# Altium project MCS_adapter.PrjPcb
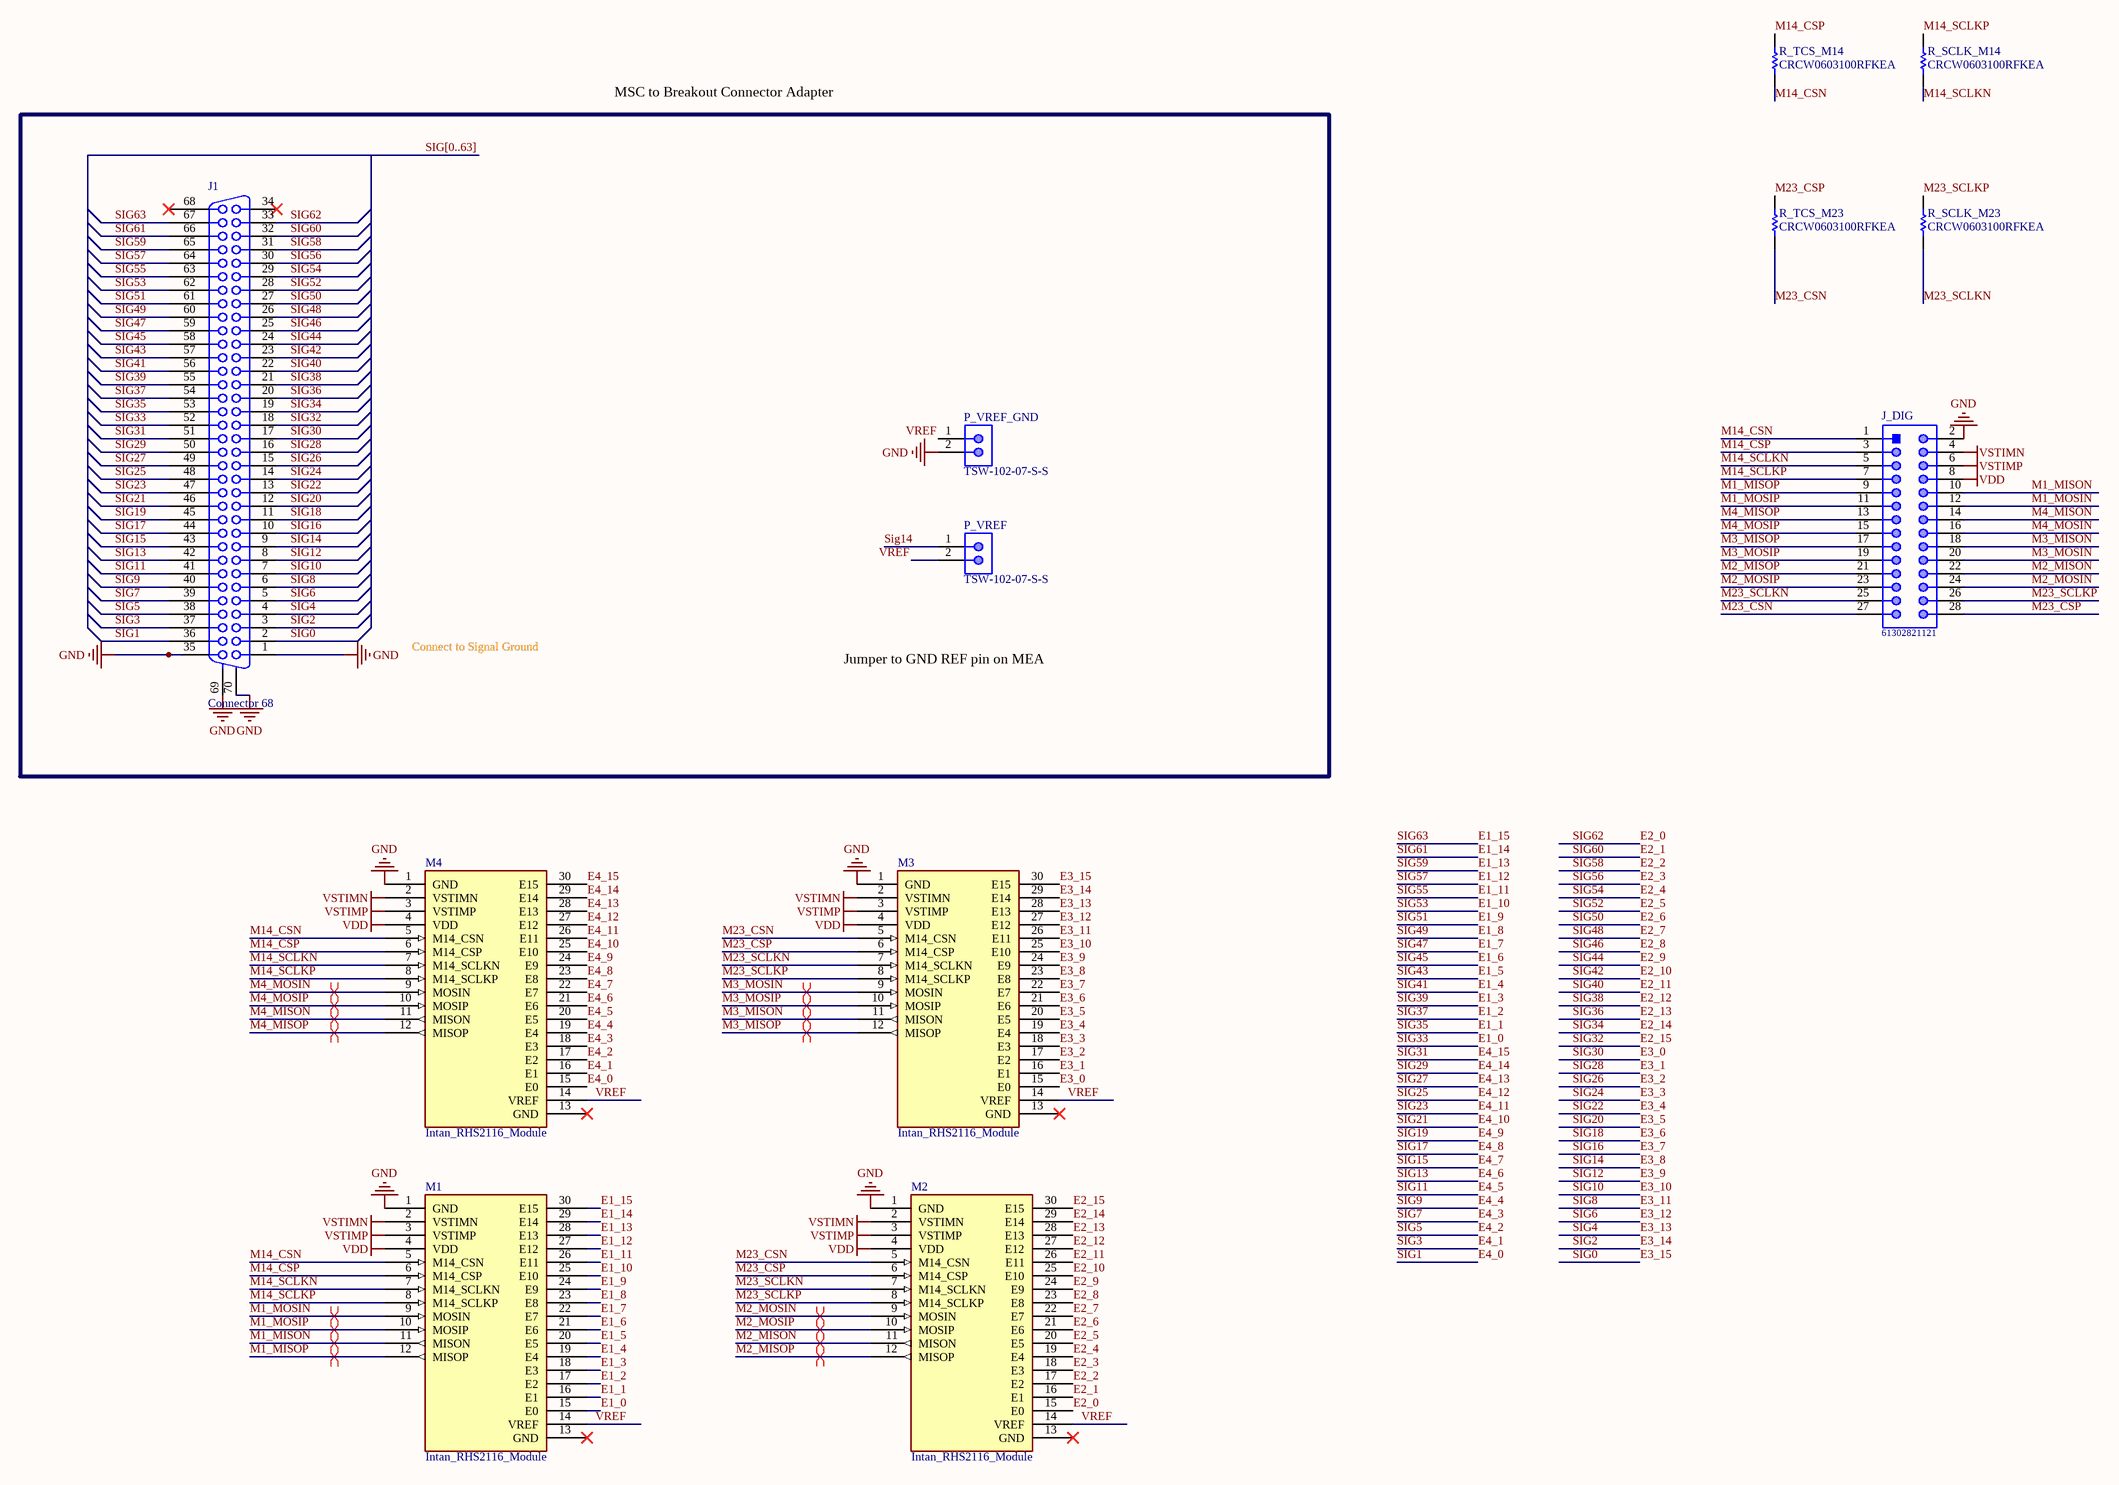
[diagram p0: MCS_adapter.SchDoc]
1 sheet, 12 parts. Net scope: hierarchical (ports join the sheet entries above them; power ports are global).
Board files: MCS_adapter_new_power_straps_t2.PcbDoc, MCS_adapter.PcbDoc

## Sheet MCS_adapter.SchDoc
size A2

### Parts
J1  Connector 68  [CONN_2-5174339-5_2-5174339-5(Primary)]
J_DIG  61302821121  [61302821121]
M1  Intan_RHS2116_Module  [Intan_RHS2116_Module]
M2  Intan_RHS2116_Module  [Intan_RHS2116_Module]
M3  Intan_RHS2116_Module  [Intan_RHS2116_Module]
M4  Intan_RHS2116_Module  [Intan_RHS2116_Module]
P_VREF  TSW-102-07-S-S  [SMTC-TSW-102-07-S-S]
P_VREF_GND  TSW-102-07-S-S  [SMTC-TSW-102-07-S-S]
R_SCLK_M14  CRCW0603100RFKEA  [RESC1609X50X30ML8T20]
R_SCLK_M23  CRCW0603100RFKEA  [RESC1609X50X30ML8T20]
R_TCS_M14  CRCW0603100RFKEA  [RESC1609X50X30ML8T20]
R_TCS_M23  CRCW0603100RFKEA  [RESC1609X50X30ML8T20]

### Nets
GND: J1.1 J1.35 J1.69(MH1) J1.70(MH2) J_DIG.2 M1.1(GND) M2.1(GND) M3.1(GND) M4.1(GND) P_VREF_GND.2
VDD: J_DIG.8 M1.4(VDD) M2.4(VDD) M3.4(VDD) M4.4(VDD)
VSTIMN: J_DIG.4 M1.2(VSTIMN) M2.2(VSTIMN) M3.2(VSTIMN) M4.2(VSTIMN)
VSTIMP: J_DIG.6 M1.3(VSTIMP) M2.3(VSTIMP) M3.3(VSTIMP) M4.3(VSTIMP)
E1_0: J1.52 M1.15(E0)  [also labelled SIG33]
E1_1: J1.53 M1.16(E1)  [also labelled SIG35]
E1_2: J1.54 M1.17(E2)  [also labelled SIG37]
E1_3: J1.55 M1.18(E3)  [also labelled SIG39]
E1_4: J1.56 M1.19(E4)  [also labelled SIG41]
E1_5: J1.57 M1.20(E5)  [also labelled SIG43]
E1_6: J1.58 M1.21(E6)  [also labelled SIG45]
E1_7: J1.59 M1.22(E7)  [also labelled SIG47]
E1_8: J1.60 M1.23(E8)  [also labelled SIG49]
E1_9: J1.61 M1.24(E9)  [also labelled SIG51]
E1_10: J1.62 M1.25(E10)  [also labelled SIG53]
E1_11: J1.63 M1.26(E11)  [also labelled SIG55]
E1_12: J1.64 M1.27(E12)  [also labelled SIG57]
E1_13: J1.65 M1.28(E13)  [also labelled SIG59]
E1_14: J1.66 M1.29(E14)  [also labelled SIG61]
E1_15: J1.67 M1.30(E15)  [also labelled SIG63]
E2_0: J1.33 M2.15(E0)  [also labelled SIG62]
E2_1: J1.32 M2.16(E1)  [also labelled SIG60]
E2_2: J1.31 M2.17(E2)  [also labelled SIG58]
E2_3: J1.30 M2.18(E3)  [also labelled SIG56]
E2_4: J1.29 M2.19(E4)  [also labelled SIG54]
E2_5: J1.28 M2.20(E5)  [also labelled SIG52]
E2_6: J1.27 M2.21(E6)  [also labelled SIG50]
E2_7: J1.26 M2.22(E7)  [also labelled SIG48]
E2_8: J1.25 M2.23(E8)  [also labelled SIG46]
E2_9: J1.24 M2.24(E9)  [also labelled SIG44]
E2_10: J1.23 M2.25(E10)  [also labelled SIG42]
E2_11: J1.22 M2.26(E11)  [also labelled SIG40]
E2_12: J1.21 M2.27(E12)  [also labelled SIG38]
E2_13: J1.20 M2.28(E13)  [also labelled SIG36]
E2_14: J1.19 M2.29(E14)  [also labelled SIG34]
E2_15: J1.18 M2.30(E15)  [also labelled SIG32]
E3_0: J1.17 M3.15(E0)  [also labelled SIG30]
E3_1: J1.16 M3.16(E1)  [also labelled SIG28]
E3_2: J1.15 M3.17(E2)  [also labelled SIG26]
E3_3: J1.14 M3.18(E3)  [also labelled SIG24]
E3_4: J1.13 M3.19(E4)  [also labelled SIG22]
E3_5: J1.12 M3.20(E5)  [also labelled SIG20]
E3_6: J1.11 M3.21(E6)  [also labelled SIG18]
E3_7: J1.10 M3.22(E7)  [also labelled SIG16]
E3_8: J1.9 M3.23(E8) P_VREF.1  [also labelled SIG14]
E3_9: J1.8 M3.24(E9)  [also labelled SIG12]
E3_10: J1.7 M3.25(E10)  [also labelled SIG10]
E3_11: J1.6 M3.26(E11)  [also labelled SIG8]
E3_12: J1.5 M3.27(E12)  [also labelled SIG6]
E3_13: J1.4 M3.28(E13)  [also labelled SIG4]
E3_14: J1.3 M3.29(E14)  [also labelled SIG2]
E3_15: J1.2 M3.30(E15)  [also labelled SIG0]
E4_0: J1.36 M4.15(E0)  [also labelled SIG1]
E4_1: J1.37 M4.16(E1)  [also labelled SIG3]
E4_2: J1.38 M4.17(E2)  [also labelled SIG5]
E4_3: J1.39 M4.18(E3)  [also labelled SIG7]
E4_4: J1.40 M4.19(E4)  [also labelled SIG9]
E4_5: J1.41 M4.20(E5)  [also labelled SIG11]
E4_6: J1.42 M4.21(E6)  [also labelled SIG13]
E4_7: J1.43 M4.22(E7)  [also labelled SIG15]
E4_8: J1.44 M4.23(E8)  [also labelled SIG17]
E4_9: J1.45 M4.24(E9)  [also labelled SIG19]
E4_10: J1.46 M4.25(E10)  [also labelled SIG21]
E4_11: J1.47 M4.26(E11)  [also labelled SIG23]
E4_12: J1.48 M4.27(E12)  [also labelled SIG25]
E4_13: J1.49 M4.28(E13)  [also labelled SIG27]
E4_14: J1.50 M4.29(E14)  [also labelled SIG29]
E4_15: J1.51 M4.30(E15)  [also labelled SIG31]
M1_MISON: J_DIG.10 M1.11(MISON)
M1_MISOP: J_DIG.9 M1.12(MISOP)
M1_MOSIN: J_DIG.12 M1.9(MOSIN)
M1_MOSIP: J_DIG.11 M1.10(MOSIP)
M2_MISON: J_DIG.22 M2.11(MISON)
M2_MISOP: J_DIG.21 M2.12(MISOP)
M2_MOSIN: J_DIG.24 M2.9(MOSIN)
M2_MOSIP: J_DIG.23 M2.10(MOSIP)
M3_MISON: J_DIG.18 M3.11(MISON)
M3_MISOP: J_DIG.17 M3.12(MISOP)
M3_MOSIN: J_DIG.20 M3.9(MOSIN)
M3_MOSIP: J_DIG.19 M3.10(MOSIP)
M4_MISON: J_DIG.14 M4.11(MISON)
M4_MISOP: J_DIG.13 M4.12(MISOP)
M4_MOSIN: J_DIG.16 M4.9(MOSIN)
M4_MOSIP: J_DIG.15 M4.10(MOSIP)
M14_CSN: J_DIG.1 M1.5(M14_CSN) M4.5(M14_CSN) R_TCS_M14.1
M14_CSP: J_DIG.3 M1.6(M14_CSP) M4.6(M14_CSP) R_TCS_M14.2
M14_SCLKN: J_DIG.5 M1.7(M14_SCLKN) M4.7(M14_SCLKN) R_SCLK_M14.1
M14_SCLKP: J_DIG.7 M1.8(M14_SCLKP) M4.8(M14_SCLKP) R_SCLK_M14.2
M23_CSN: J_DIG.27 M2.5(M14_CSN) M3.5(M14_CSN) R_TCS_M23.1
M23_CSP: J_DIG.28 M2.6(M14_CSP) M3.6(M14_CSP) R_TCS_M23.2
M23_SCLKN: J_DIG.25 M2.7(M14_SCLKN) M3.7(M14_SCLKN) R_SCLK_M23.1
M23_SCLKP: J_DIG.26 M2.8(M14_SCLKP) M3.8(M14_SCLKP) R_SCLK_M23.2
VREF: M1.14(VREF) M2.14(VREF) M3.14(VREF) M4.14(VREF) P_VREF.2 P_VREF_GND.1

Not connected (* = marked no-connect by the designer): J1 34* 68*; M1 13(GND)*; M2 13(GND)*; M3 13(GND)*; M4 13(GND)*

### Buses and harness runs
bus SIG[0..63]

### Layout directives
differential pair: M1_MISON, M1_MISOP, M1_MOSIN, M1_MOSIP, M2_MISON, M2_MISOP, M2_MOSIN, M2_MOSIP, M3_MISON, M3_MISOP, M3_MOSIN, M3_MOSIP, M4_MISON, M4_MISOP, M4_MOSIN, M4_MOSIP

### Notes on the sheet
- MSC to Breakout Connector Adapter
- Connect to Signal Ground
- Jumper to GND REF pin on MEA

### Library data of the parts
J1 = Connector 68: Receptacle Header Assemby; Manufacturer: TE Connectivity; ManufacturerPartNumber: 2-5174339-5; Pricing1: 1=29.61;  10=26.727;  25=25.60760;  50=24.007  (CAD); Supplier 1: Digi-Key; ComponentLink1Description: Datasheet; ComponentLink1URL: https://www.te.com/commerce/DocumentDelivery/DDEController?Action=srchrtrv&DocNm=5174339&DocType=Customer+Drawing&DocLang=English; Stock1: 1335; Supplier Link 1: https://www.digikey.ca/product-detail/en/te-connectivity-amp-connectors/2-5174339-5/A121355-ND/1835651; Manufacturer Link: https://www.te.com/usa-en/product-2-5174339-5.html#pdp-docs-features; Supplier Part Number 1: A121355-ND
J_DIG = CMP-1502-01115-1: THT Vertical Pin Header WR-PHD, Pitch 2.54 mm, Dual Row, 28 pins; Manufacturer: Wurth Elektronik; Pin Number: 28; Contact Resistance: 20mOhm; Withstanding Voltage: 500VAC; Pitch: 2.54mm; Gender: Male; Working Voltage: 250VAC; Rated Current: 3A; Package Reference: 61302821121; Part Number: 61302821121; Mounting Technology: THT; Packaging: Bag; Manufacturer URL: http://www.we-online.de; Row Number: Dual; Orientation: Vertical; Operating Temperature: -40to105degC; Datasheet URL: https://katalog.we-online.de/em/datasheet/6130xx21121.pdf; Publisher: WurthElektronik
P_VREF P_VREF_GND = CMP-1681-00004-4: Male Header, Pitch 2.54 mm, 1 x 2 Position, Height 8.38 mm, Tail Length 2.54 mm, -55 to 125 degC, RoHS, Bulk; Manufacturer: Samtec; Rows: 1; ComponentLink1URL: http://www.samtec.com/; Contact Finish: Gold; Mounting Technology: Through Hole; PackageReference: TSW-102-07-S-S; RoHSCompliant: true; Pins: 2; Contact Material: Bronze; ComponentLink2Description: Datasheet; Max Operating Temperature: 125 degC; Min Operating Temperature: -55 degC; Height: 8.38 mm; Packaging: Bulk; ComponentLink1Description: Manufacturer URL; PackageDescription: Male Header, Pitch 2.54 mm, 1 x 2 Position, Height 8.38 mm, Tail Length 2.54 mm; Colour: Black; Contact Plating: Gold; Length: 5.08 mm; ComponentLink2URL: http://suddendocs.samtec.com/catalog_english/tsw_th.pdf; DatasheetVersion: 12/2015; Mount: Through Hole; Lead Pitch: 0.1 inch; REACH SVHC: No SVHC; Package Quantity: 1
R_SCLK_M14 R_SCLK_M23 R_TCS_M14 R_TCS_M23 = CMP-1666-00008-4: Chip Resistor, 100 Ohm, +/- 1%, 100 mW,-55 to 155 degC, 0603 (1608 Metric), RoHS, Tape and Ree; Manufacturer: Vishay Semiconductor; ComponentLink2URL: http://www.vishay.com/docs/20035/dcrcwe3.pdf; ComponentLink1URL: http://www.vishay.com/; Mounting Technology: Surface Mount; ComponentLink1Description: Manufacturer URL; ComponentLink2Description: Datasheet; PackageDescription: 2-Pin Surface Mount Device, Body 1.575 x 0.85 mm; PackageReference: 0603; DatasheetVersion: 06/2012